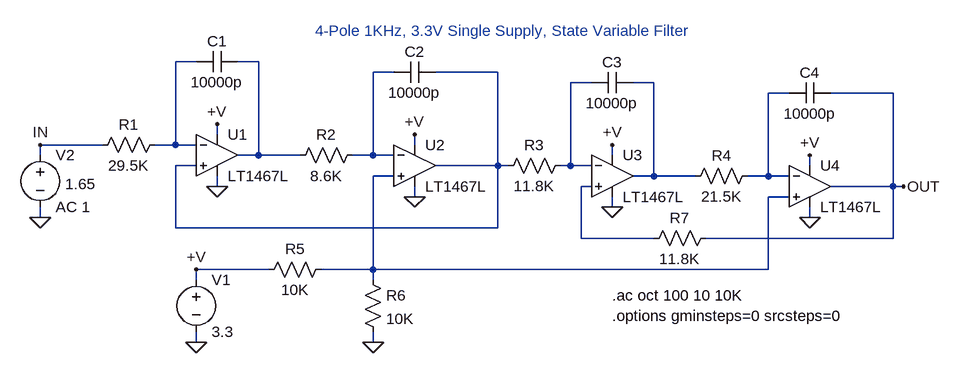
[diagram p0: schematic 1467L.asc]
1467L.asc, the LTspice schematic file:
Version 4
SHEET 1 1416 720
WIRE 208 -32 176 -32
WIRE 304 -32 272 -32
WIRE 512 -16 480 -16
WIRE 672 -16 576 -16
WIRE 816 0 784 0
WIRE 912 0 880 0
WIRE 1120 16 1088 16
WIRE 1280 16 1184 16
WIRE 240 80 240 64
WIRE 64 96 -32 96
WIRE 176 96 176 -32
WIRE 176 96 144 96
WIRE 208 96 176 96
WIRE 544 96 544 80
WIRE -32 112 -32 96
WIRE 304 112 304 -32
WIRE 304 112 272 112
WIRE 368 112 304 112
WIRE 480 112 480 -16
WIRE 480 112 448 112
WIRE 512 112 480 112
WIRE 848 112 848 96
WIRE 208 128 176 128
WIRE 672 128 672 -16
WIRE 672 128 576 128
WIRE 688 128 672 128
WIRE 784 128 784 0
WIRE 784 128 768 128
WIRE 816 128 784 128
WIRE 1152 128 1152 112
WIRE 512 144 480 144
WIRE 912 144 912 0
WIRE 912 144 880 144
WIRE 976 144 912 144
WIRE 1088 144 1088 16
WIRE 1088 144 1056 144
WIRE 1120 144 1088 144
WIRE 240 160 240 144
WIRE 816 160 800 160
WIRE 1280 160 1280 16
WIRE 1280 160 1184 160
WIRE 1296 160 1280 160
WIRE 544 176 544 160
WIRE 1120 176 1088 176
WIRE 848 192 848 176
WIRE -32 208 -32 192
WIRE 1152 208 1152 192
WIRE 176 224 176 128
WIRE 672 224 672 128
WIRE 672 224 176 224
WIRE 800 240 800 160
WIRE 912 240 800 240
WIRE 1280 240 1280 160
WIRE 1280 240 992 240
WIRE 320 288 208 288
WIRE 480 288 480 144
WIRE 480 288 400 288
WIRE 1088 288 1088 176
WIRE 1088 288 480 288
WIRE 208 304 208 288
WIRE 480 304 480 288
WIRE 208 400 208 384
WIRE 480 400 480 384
FLAG 208 400 0
FLAG 240 64 +V
FLAG 208 288 +V
FLAG 1296 160 OUT
FLAG -32 96 IN
FLAG -32 208 0
FLAG 544 80 +V
FLAG 848 96 +V
FLAG 1152 112 +V
FLAG 240 160 0
FLAG 544 176 0
FLAG 848 192 0
FLAG 1152 208 0
FLAG 480 400 0
SYMBOL voltage 208 288 R0
SYMATTR InstName V1
SYMATTR Value 3.3
SYMBOL res 160 80 R90
WINDOW 0 0 56 VBottom 2
WINDOW 3 32 56 VTop 2
SYMATTR InstName R1
SYMATTR Value 29.5K
SYMBOL voltage -32 96 R0
WINDOW 123 24 96 Left 2
WINDOW 39 0 0 Left 2
WINDOW 3 38 60 Left 2
SYMATTR Value2 AC 1
SYMATTR Value 1.65
SYMATTR InstName V2
SYMBOL cap 272 -48 R90
WINDOW 0 0 32 VBottom 2
WINDOW 3 32 32 VTop 2
SYMATTR InstName C1
SYMATTR Value 10000p
SYMBOL res 464 96 R90
WINDOW 0 0 56 VBottom 2
WINDOW 3 32 56 VTop 2
SYMATTR InstName R2
SYMATTR Value 8.6K
SYMBOL cap 576 -32 R90
WINDOW 0 0 32 VBottom 2
WINDOW 3 32 32 VTop 2
SYMATTR InstName C2
SYMATTR Value 10000p
SYMBOL res 784 112 R90
WINDOW 0 0 56 VBottom 2
WINDOW 3 32 56 VTop 2
SYMATTR InstName R3
SYMATTR Value 11.8K
SYMBOL cap 880 -16 R90
WINDOW 0 0 32 VBottom 2
WINDOW 3 32 32 VTop 2
SYMATTR InstName C3
SYMATTR Value 10000p
SYMBOL res 1072 128 R90
WINDOW 0 0 56 VBottom 2
WINDOW 3 32 56 VTop 2
SYMATTR InstName R4
SYMATTR Value 21.5K
SYMBOL cap 1184 0 R90
WINDOW 0 0 32 VBottom 2
WINDOW 3 32 32 VTop 2
SYMATTR InstName C4
SYMATTR Value 10000p
SYMBOL res 416 272 R90
WINDOW 0 0 56 VBottom 2
WINDOW 3 32 56 VTop 2
SYMATTR InstName R5
SYMATTR Value 10K
SYMBOL res 464 288 R0
SYMATTR InstName R6
SYMATTR Value 10K
SYMBOL res 1008 224 R90
WINDOW 0 0 56 VBottom 2
WINDOW 3 32 56 VTop 2
SYMATTR InstName R7
SYMATTR Value 11.8K
SYMBOL opamps\\LT1467L 240 48 R0
SYMATTR InstName U1
SYMBOL opamps\\LT1467L 544 64 R0
SYMATTR InstName U2
SYMBOL opamps\\LT1467L 848 80 R0
SYMATTR InstName U3
SYMBOL opamps\\LT1467L 1152 96 R0
SYMATTR InstName U4
TEXT 848 328 Left 2 !.ac oct 100 10 10K\n.options gminsteps=0 srcsteps=0
TEXT 680 -64 Bottom 2 ;4-Pole 1KHz, 3.3V Single Supply, State Variable Filter

The netlist it stands for:
* 1467L.asc
V1 +V 0 3.3
R1 N001 IN 29.5K
V2 IN 0 1.65 AC 1
C1 N002 N001 10000p
R2 N003 N002 8.6K
C2 N004 N003 10000p
R3 N005 N004 11.8K
C3 N006 N005 10000p
R4 N007 N006 21.5K
C4 OUT N007 10000p
R5 N008 +V 10K
R6 N008 0 10K
R7 OUT N009 11.8K
XU1 N004 N001 +V 0 N002 LT1467L  ; pins In+ In- V+ V- OUT
XU2 N008 N003 +V 0 N004 LT1467L  ; pins In+ In- V+ V- OUT
XU3 N009 N005 +V 0 N006 LT1467L  ; pins In+ In- V+ V- OUT
XU4 N008 N007 +V 0 OUT LT1467L  ; pins In+ In- V+ V- OUT
.ac oct 100 10 10K
.options gminsteps=0 srcsteps=0
* 4-Pole 1KHz, 3.3V Single Supply, State Variable Filter
.backanno
.end